# Altium schematic sheet Main.SchDoc
size A4; SheetNumber: 1; SheetTotal: 1
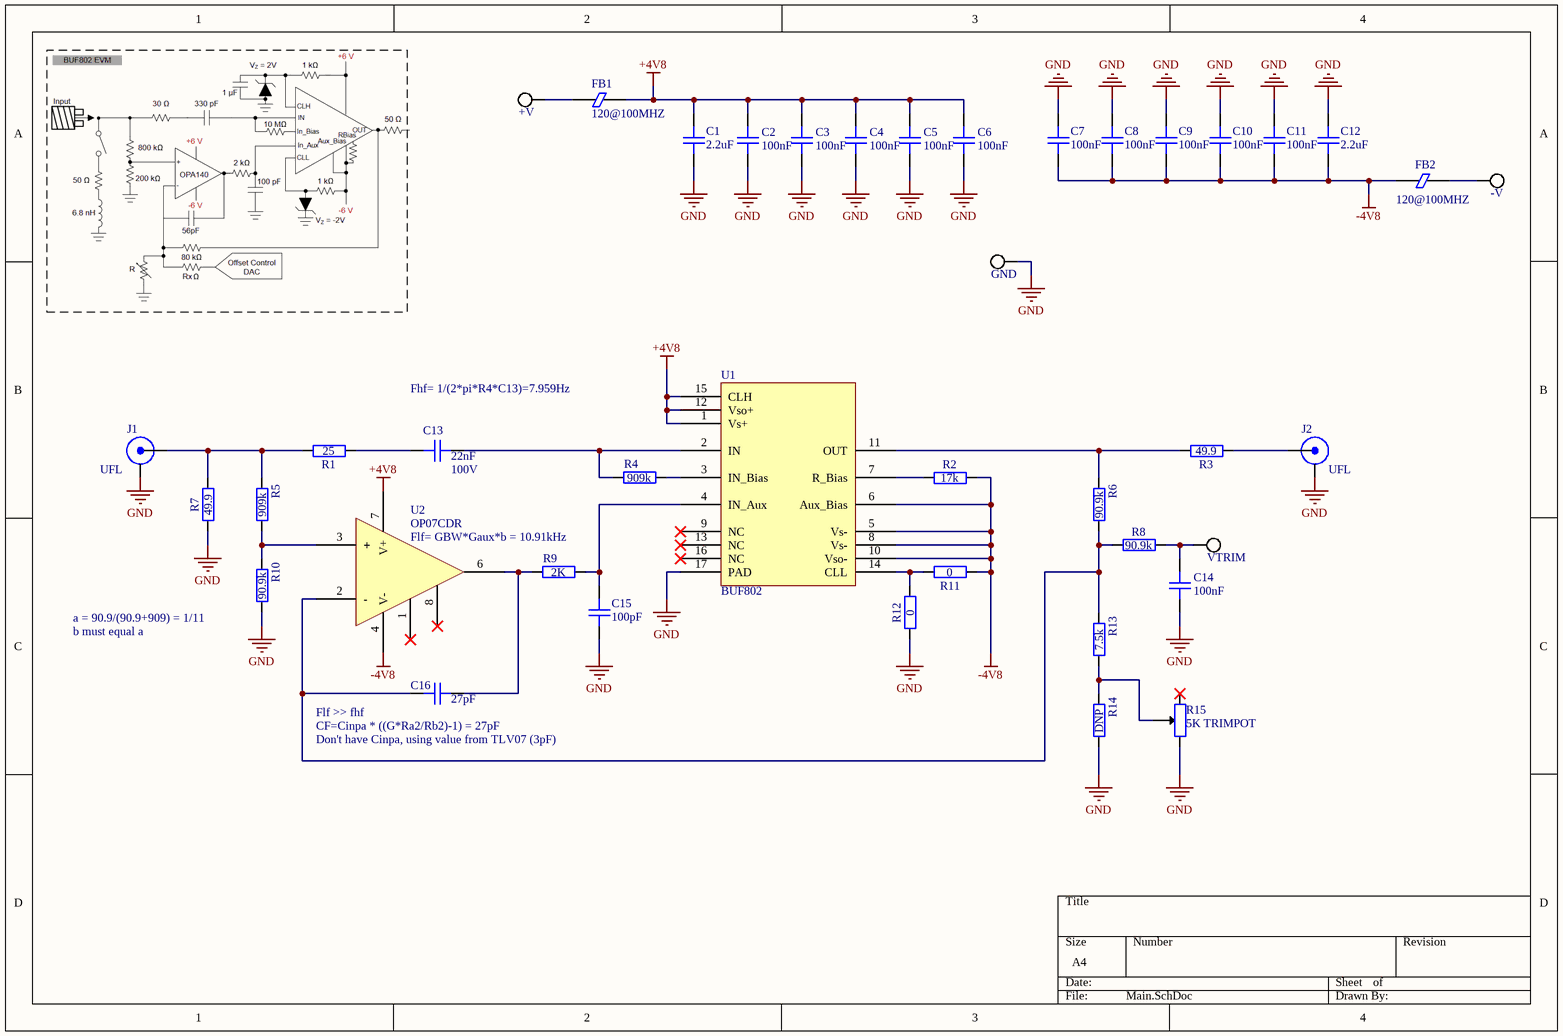
[diagram p0: Main.SchDoc]

## Parts
+V  PCB  [GEN_TP_PCB]  (value not drawn)  (no BOM)
-V  PCB  [GEN_TP_PCB]  (value not drawn)  (no BOM)
C1  2.2uF  [GEN_C_0402]
C2  100nF  [GEN_C_0402]
C3  100nF  [GEN_C_0402]
C4  100nF  [GEN_C_0402]
C5  100nF  [GEN_C_0402]
C6  100nF  [GEN_C_0402]
C7  100nF  [GEN_C_0402]
C8  100nF  [GEN_C_0402]
C9  100nF  [GEN_C_0402]
C10  100nF  [GEN_C_0402]
C11  100nF  [GEN_C_0402]
C12  2.2uF  [GEN_C_0402]
C13  22nF  Voltage Rating: 100V  [GEN_C_0603]
C14  100nF  [GEN_C_0402]
C15  100pF  [GEN_C_0402]
C16  27pF  [GEN_C_0402]
FB1  120@100MHZ  [GEN_R_0402]
FB2  120@100MHZ  [GEN_R_0402]
GND  PCB  [GEN_TP_PCB]  (value not drawn)  (no BOM)
J1  UFL  [TE_2334884-1]
J2  UFL  [TE_2334884-1]
R1  25  [GEN_R_0402]
R2  17k  [GEN_R_0402]
R3  49.9  [GEN_R_0402]
R4  909k  [GEN_R_0402]
R5  909k  [GEN_R_0402]
R6  90.9k  [GEN_R_0402]
R7  49.9  [GEN_R_0402]
R8  90.9k  [GEN_R_0402]
R9  2K  [GEN_R_0402]
R10  90.9k  [GEN_R_0402]
R11  0  [GEN_R_0402]
R12  0  [GEN_R_0402]
R13  7.5k  [GEN_R_0402]
R14  DNP  [GEN_R_0402]  (no BOM)
R15  5K TRIMPOT  [BOU_3mm_POT]
U1  BUF802  [TI_VQFN_RGT0016C]
U2  OP07CDR  [TI_SOIC8_D0008A]
VTRIM  PCB  [GEN_TP_PCB]  (value not drawn)  (no BOM)

## Nets
+4V8: C1.2 C2.1 C3.1 C4.1 C5.2 C6.2 FB1.2 U1.1(Vs+) U1.12(Vso+) U1.15(CLH) U2.7(V+)
-4V8: C7.2 C8.2 C9.1 C10.1 C11.1 C12.2 FB2.1 R2.2 R11.1 U1.5(Vs-) U1.6(Aux_Bias) U1.8(Vs-) U1.10(Vso-) U2.4(V-)
GND: C1.1 C2.2 C3.2 C4.2 C5.1 C6.1 C7.1 C8.1 C9.2 C10.2 C11.2 C12.1 C14.2 C15.1 GND.1 J1.2(SHIELD) J2.2(SHIELD) R7.1 R10.1 R12.1 R14.1 R15.3 U1.17(PAD)
Net+V_1: +V.1 FB1.1
Net-V_1: -V.1 FB2.2
NetC13_1: C13.1 R4.2 U1.2(IN)
NetC13_2: C13.2 R1.2
NetC14_1: C14.1 R8.1 VTRIM.1
NetC15_2: C15.2 R9.1 U1.4(IN_Aux)
NetC16_1: C16.1 R9.2 U2.6(OUT)
NetC16_2: C16.2 R6.1 R8.2 R13.2 U2.2(-)
NetJ1_1: J1.1(Signal) R1.1 R5.2 R7.2
NetJ2_1: J2.1(Signal) R3.2
NetR2_1: R2.1 U1.7(R_Bias)
NetR3_1: R3.1 R6.2 U1.11(OUT)
NetR4_1: R4.1 U1.3(IN_Bias)
NetR5_1: R5.1 R10.2 U2.3(+)
NetR11_2: R11.2 R12.2 U1.14(CLL)
NetR13_1: R13.1 R14.2 R15.2

Not connected (* = marked no-connect by the designer): R15 1*; U1 9(NC)* 13(NC)* 16(NC)*; U2 1(N1)* 8(N2)*

## Notes on the sheet
- Fhf= 1/(2*pi*R4*C13)=7.959Hz
- (near U2) Flf= GBW*Gaux*b = 10.91kHz
- (near R10) a = 90.9/(90.9+909) = 1/11
- b must equal a
- (near C16) Flf >> fhf
- (near C16) CF=Cinpa * ((G*Ra2/Rb2)-1) = 27pF
- (near C16) Don't have Cinpa, using value from TLV07 (3pF)

## Library data of the parts
+V -V GND VTRIM = TP PCB 1mm
C1 C12 = CAP 2.2uF 10V X5R 0402: Voltage Rating: 10V; Package: 0402; Supplier 1: Digi-Key; Supplier Part Number 1: 587-3153-1-ND; Value: 2.2uF
C2-C11 C14 = CAP 100nF 16V X7R 0402: Voltage Rating: 16V; Package: 0402; Supplier 1: Digi-Key; Supplier Part Number 1: 490-4759-1-ND; Value: 100nF
C13 = CAP 22nF 100V X7R 0603: Package: 0603; Value: 22nF; Supplier 1: Digi-Key; Supplier Part Number 1: 490-4782-1-ND
C15 = CAP 100pF 50V C0G 0402: Temperature Coefficient: C0G; Voltage Rating: 50V; Package: 0402; Value: 100pF; Supplier 1: Digi-Key; Supplier Part Number 1: 490-14349-1-ND
C16 = CAP TBD 0402: Value: TBD; Package: 0402
FB1 FB2 = FERRITE BEAD 120 OHM 0402: Supplier 1: Digi-Key; Supplier Part Number 1: 490-9656-1-ND
J1 J2 = UFL Jack SMD: Supplier 1: Digi-Key; Supplier Part Number 1: A145155CT-ND
R1 = RES 49.9 OHM 1% 1/10W 0402: Tolerance: 1%; Power Rating: 0.1W; Value: 49.9; Package: 0402; Supplier 1: Digi-Key; Supplier Part Number 1: 311-49.9LRCT-ND
R2 = RES 100K OHM 1% 1/10W 0402: Tolerance: 1%; Power Rating: 0.1W; Value: 100k; Package: 0402; Supplier 1: Digi-Key; Supplier Part Number 1: 311-100KLRCT-ND
R3 R7 = RES 49.9 OHM 1% 1/10W 0402: Tolerance: 1%; Power Rating: 0.1W; Package: 0402; Supplier 1: Digi-Key; Supplier Part Number 1: 311-49.9LRCT-ND; Value: 49.9
R4 R5 = RES 909K OHM 1% 1/16W 0402: Tolerance: 1%; Power Rating: 0.0625W; Package: 0402; Supplier 1: Digi-Key; Supplier Part Number 1: YAG2377CT-ND; Value: 909k
R6 R8 R10 = RES 90.9K OHM 1% 1/16W 0402: Tolerance: 1%; Power Rating: 0.0625W; Package: 0402; Supplier 1: Digi-Key; Supplier Part Number 1: 311-90.9KLRCT-ND; Value: 90.9k
R9 = RES 2K OHM 1% 1/16W 0402: Tolerance: 1%; Power Rating: 0.0625W; Package: 0402; Supplier 1: Digi-Key; Supplier Part Number 1: 311-2KLRCT-ND; Value: 2K
R11 R12 = RES 0 OHM 1/16W 0402: Power Rating: 0.0625W; Package: 0402; Supplier 1: Digi-Key; Supplier Part Number 1: 311-0.0JRCT-ND; Value: 0
R13 = RES 10K OHM 1% 1/10W 0402: Tolerance: 1%; Power Rating: 0.1W; Value: 10K; Package: 0402; Supplier 1: Digi-Key; Supplier Part Number 1: P10.0KLCT-ND
R14 = RES DNP 0402: Tolerance: 1%; Power Rating: 0.0625W; Package: 0402; Value: DNP
R15 = TRIMMER 5K OHM 0.1W J LEAD TOP: Tolerance: 1%; Power Rating: 0.1W; Supplier 1: Digi-Key; Supplier Part Number 1: TC33X-502ECT-ND; Value: 5K
U1 = IC BUFFER AMP BUF802
U2 = IC OPAMP OP07CDR: Supplier 1: Digi-Key; Supplier Part Number 1: 296-14626-1-ND